# Altium schematic sheet Sheet1.SchDoc
size A; SheetNumber: 1; SheetTotal: 3
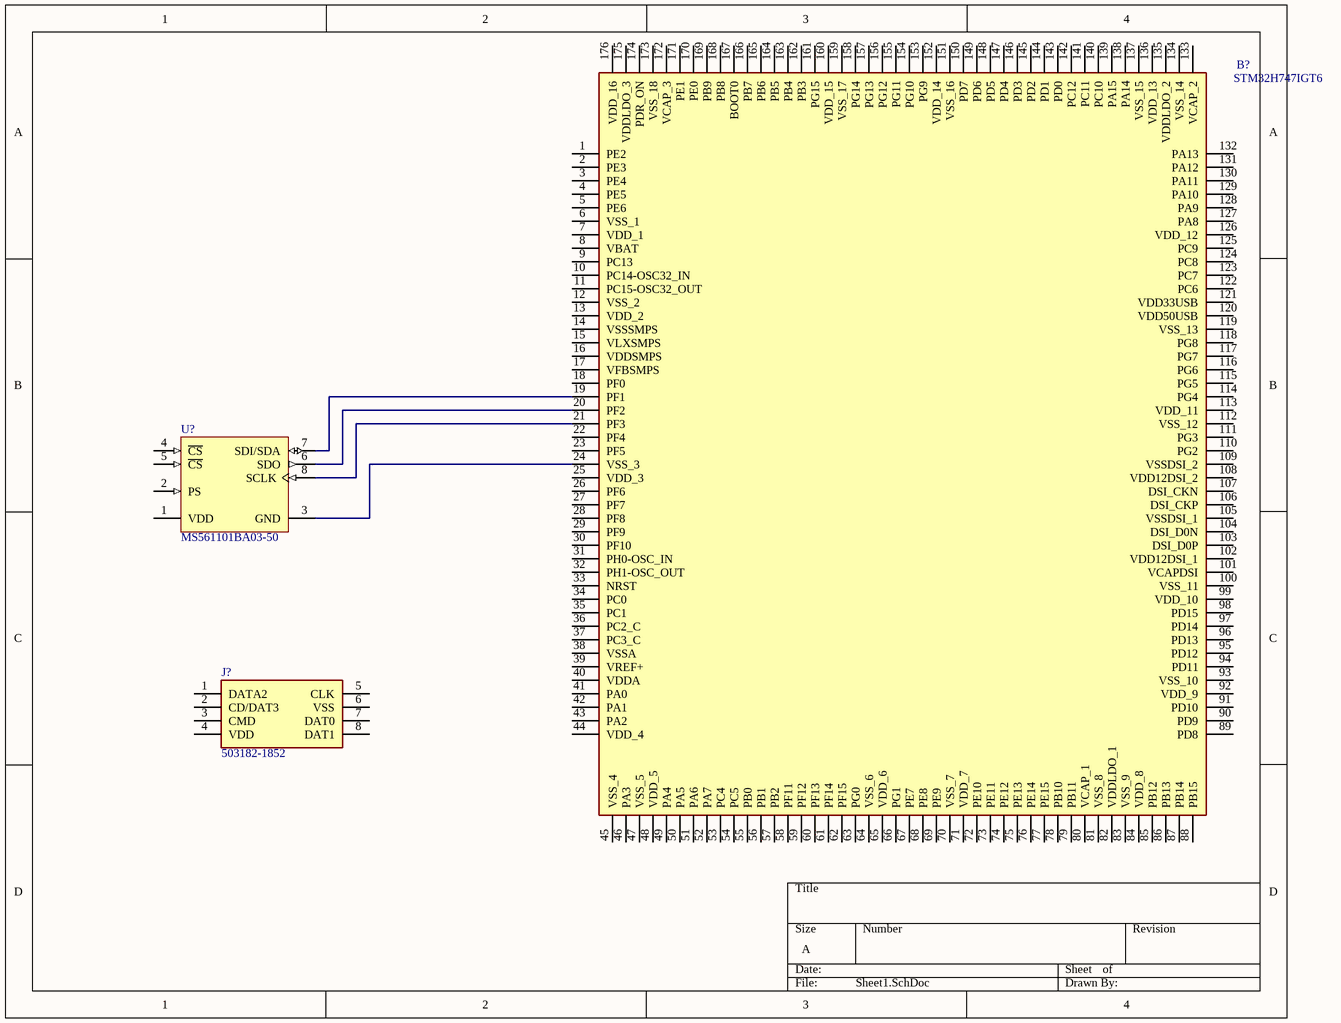
[diagram p0: Sheet1.SchDoc]

## Parts
B?  STM32H747IGT6  [QFP50P2600X2600X160-176N]
J?  503182-1852  [5031821852]
U?  MS561101BA03-50  [MSI-MS561101BA03-50-8_V]

## Nets
NetB?_19: B?.19(PF1) U?.7(SDI/SDA)
NetB?_20: B?.20(PF2) U?.6(SDO)
NetB?_21: B?.21(PF3) U?.8(SCLK)
NetB?_24: B?.24(VSS_3) U?.3(GND)

Not connected (* = marked no-connect by the designer): B? 1(PE2) 2(PE3) 3(PE4) 4(PE5) 5(PE6) 6(VSS_1) 7(VDD_1) 8(VBAT) 9(PC13) 10(PC14-OSC32_IN) 11(PC15-OSC32_OUT) 12(VSS_2) 13(VDD_2) 14(VSSSMPS) 15(VLXSMPS) 16(VDDSMPS) 17(VFBSMPS) 18(PF0) 22(PF4) 23(PF5) 25(VDD_3) 26(PF6) 27(PF7) 28(PF8) 29(PF9) 30(PF10) 31(PH0-OSC_IN) 32(PH1-OSC_OUT) 33(NRST) 34(PC0) 35(PC1) 36(PC2_C) 37(PC3_C) 38(VSSA) 39(VREF+) 40(VDDA) 41(PA0) 42(PA1) 43(PA2) 44(VDD_4) 45(VSS_4) 46(PA3) 47(VSS_5) 48(VDD_5) 49(PA4) 50(PA5) 51(PA6) 52(PA7) 53(PC4) 54(PC5) 55(PB0) 56(PB1) 57(PB2) 58(PF11) 59(PF12) 60(PF13) 61(PF14) 62(PF15) 63(PG0) 64(VSS_6) 65(VDD_6) 66(PG1) 67(PE7) 68(PE8) 69(PE9) 70(VSS_7) 71(VDD_7) 72(PE10) 73(PE11) 74(PE12) 75(PE13) 76(PE14) 77(PE15) 78(PB10) 79(PB11) 80(VCAP_1) 81(VSS_8) 82(VDDLDO_1) 83(VSS_9) 84(VDD_8) 85(PB12) 86(PB13) 87(PB14) 88(PB15) 89(PD8) 90(PD9) 91(PD10) 92(VDD_9) 93(VSS_10) 94(PD11) 95(PD12) 96(PD13) 97(PD14) 98(PD15) 99(VDD_10) 100(VSS_11) 101(VCAPDSI) 102(VDD12DSI_1) 103(DSI_D0P) 104(DSI_D0N) 105(VSSDSI_1) 106(DSI_CKP) 107(DSI_CKN) 108(VDD12DSI_2) 109(VSSDSI_2) 110(PG2) 111(PG3) 112(VSS_12) 113(VDD_11) 114(PG4) 115(PG5) 116(PG6) 117(PG7) 118(PG8) 119(VSS_13) 120(VDD50USB) 121(VDD33USB) 122(PC6) 123(PC7) 124(PC8) 125(PC9) 126(VDD_12) 127(PA8) 128(PA9) 129(PA10) 130(PA11) 131(PA12) 132(PA13) 133(VCAP_2) 134(VSS_14) 135(VDDLDO_2) 136(VDD_13) 137(VSS_15) 138(PA14) 139(PA15) 140(PC10) 141(PC11) 142(PC12) 143(PD0) 144(PD1) 145(PD2) 146(PD3) 147(PD4) 148(PD5) 149(PD6) 150(PD7) 151(VSS_16) 152(VDD_14) 153(PG9) 154(PG10) 155(PG11) 156(PG12) 157(PG13) 158(PG14) 159(VSS_17) 160(VDD_15) 161(PG15) 162(PB3) 163(PB4) 164(PB5) 165(PB6) 166(PB7) 167(BOOT0) 168(PB8) 169(PB9) 170(PE0) 171(PE1) 172(VCAP_3) 173(VSS_18) 174(PDR_ON) 175(VDDLDO_3) 176(VDD_16); J? 1(DATA2) 2(CD/DAT3) 3(CMD) 4(VDD) 5(CLK) 6(VSS) 7(DAT0) 8(DAT1); U? 1(VDD) 2(PS) 4(~{CS}) 5(~{CS})

## Library data of the parts
B? = STM32H747IGT6: ARM Microcontrollers - MCU 16/32-BITS MICROS; Manufacturer_Name: STMicroelectronics; Geometry.Height: 1.6mm; Manufacturer_Part_Number: STM32H747IGT6; Mouser Part Number: 511-STM32H747IGT6; Mouser Price/Stock: https://www.mouser.co.uk/ProductDetail/STMicroelectronics/STM32H747IGT6?qs=%252B6g0mu59x7Kw%252BsPEalqvLg%3D%3D; Arrow Part Number: STM32H747IGT6; Arrow Price/Stock: https://www.arrow.com/en/products/stm32h747igt6/stmicroelectronics?region=nac; Datasheet Link: https://www.mouser.com/datasheet/2/389/dm00602212-1799407.pdf
J? = 503182-1852: Connector; Manufacturer_Name: Molex; Datasheet Link: https://www.molex.com/pdm_docs/sd/5031821852_sd.pdf; Manufacturer_Part_Number: 503182-1852; Mouser Part Number: 538-503182-1852; Mouser Price/Stock: https://www.mouser.co.uk/ProductDetail/Molex/503182-1852?qs=s7UCm7gO1bZmpyAhCKZ26g%3D%3D
U? = CMP-2000-05251-1: Barometric Pressure Sensor, with Stainless Steel Cap, 1.8 to 3.6 V, -45 to 85 degC, 8-Pin QFN, RoHS, Tape and Reel; Manufacturer: Measurement Specialties; Operating Pressure Max: 1200mbar; Supply Current: 12.5µA; Supply Voltage Max: 3.6V; Supply Voltage Min: 1.8V; No. of Pins: 8; Connection Size: 0.5mm; SVHC: NoSVHC(20-Jun-2013); Operating Pressure Min: 10mbar; Manufacturer URL: http://www.meas-spec.com/; Operating Temperature Min: -40degC; Pressure Type: Barometric; Package Reference: MS561101BA03-50-8; Datasheet URL: http://www.te.com/commerce/DocumentDelivery/DDEController?Action=srchrtrv&DocNm=MS5611-01BA03&DocType=Data+Sheet&DocLang=English&DocFormat=pdf&PartCntxt=CAT-BLPS0036; Package Description: 8-Pin Surface Mount Device, Body 5 x 3 mm, Pitch 1.25 mm; Sensor Case Style: QFN; Datasheet Version: Sep-15; Operating Temperature Max: 85degC